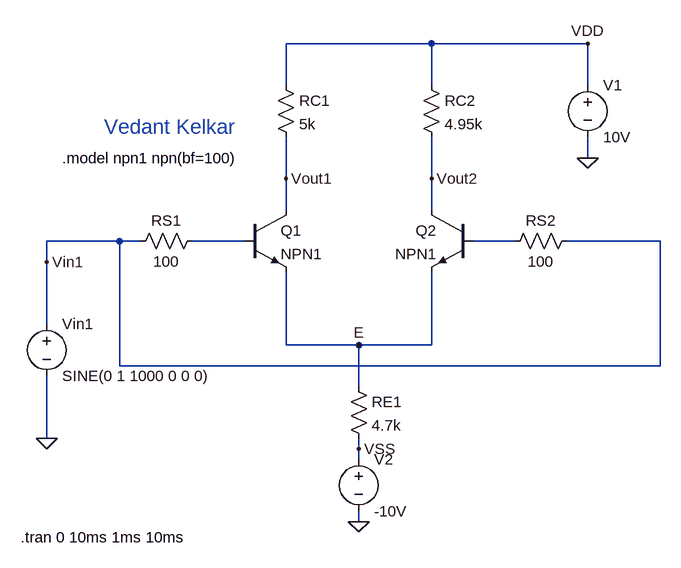
[diagram p0: schematic ECAD_exp9b.asc]
ECAD_exp9b.asc, the LTspice schematic file:
Version 4
SHEET 1 880 680
WIRE 192 -224 -32 -224
WIRE 432 -224 192 -224
WIRE -32 -160 -32 -224
WIRE 192 -160 192 -224
WIRE 432 -160 432 -224
WIRE 432 -48 432 -80
WIRE -32 -16 -32 -80
WIRE 192 -16 192 -80
WIRE -32 32 -32 -16
WIRE 192 32 192 -16
WIRE -288 80 -400 80
WIRE -256 80 -288 80
WIRE -96 80 -176 80
WIRE 320 80 256 80
WIRE 544 80 400 80
WIRE -400 112 -400 80
WIRE -400 208 -400 112
WIRE -32 240 -32 128
WIRE 80 240 -32 240
WIRE 192 240 192 128
WIRE 192 240 80 240
WIRE -288 272 -288 80
WIRE 544 272 544 80
WIRE 544 272 -288 272
WIRE 80 304 80 240
WIRE -400 384 -400 288
WIRE 80 400 80 384
WIRE 80 416 80 400
WIRE 80 512 80 496
FLAG -400 384 0
FLAG 80 240 E
FLAG 432 -48 0
FLAG 80 512 0
FLAG 432 -224 VDD
FLAG 80 400 VSS
FLAG -400 112 Vin1
FLAG -32 -16 Vout1
FLAG 192 -16 Vout2
SYMBOL voltage -400 192 R0
WINDOW 123 0 0 Left 0
WINDOW 39 0 0 Left 0
SYMATTR InstName Vin1
SYMATTR Value SINE(0 1 1000 0 0 0)
SYMBOL res -160 64 R90
WINDOW 0 0 56 VBottom 2
WINDOW 3 32 56 VTop 2
SYMATTR InstName RS1
SYMATTR Value 100
SYMBOL npn -96 32 R0
SYMATTR InstName Q1
SYMATTR Value NPN1
SYMBOL res -48 -176 R0
SYMATTR InstName RC1
SYMATTR Value 5k
SYMBOL res 416 64 R90
WINDOW 0 0 56 VBottom 2
WINDOW 3 32 56 VTop 2
SYMATTR InstName RS2
SYMATTR Value 100
SYMBOL npn 256 32 M0
SYMATTR InstName Q2
SYMATTR Value NPN1
SYMBOL res 176 -176 R0
SYMATTR InstName RC2
SYMATTR Value 4.95k
SYMBOL res 64 288 R0
SYMATTR InstName RE1
SYMATTR Value 4.7k
SYMBOL voltage 432 -176 R0
WINDOW 123 0 0 Left 0
WINDOW 39 0 0 Left 0
SYMATTR InstName V1
SYMATTR Value 10V
SYMBOL voltage 80 400 R0
WINDOW 123 0 0 Left 0
WINDOW 39 0 0 Left 0
SYMATTR InstName V2
SYMATTR Value -10V
TEXT -376 -48 Left 2 !.model npn1 npn(bf=100)
TEXT -440 536 Left 2 !.tran 0 10ms 1ms 10ms
TEXT -312 -96 Left 3 ;Vedant Kelkar

The netlist it stands for:
* ECAD_exp9b.asc
Vin1 Vin1 0 SINE(0 1 1000 0 0 0)
RS1 N001 Vin1 100
Q1 Vout1 N001 E 0 NPN1
RC1 VDD Vout1 5k
RS2 Vin1 N002 100
Q2 Vout2 N002 E 0 NPN1
RC2 VDD Vout2 4.95k
RE1 E VSS 4.7k
V1 VDD 0 10V
V2 VSS 0 -10V
.model NPN NPN
.model PNP PNP
.lib standard.bjt
.model npn1 npn(bf=100)
.tran 0 10ms 1ms 10ms
* Vedant Kelkar
.backanno
.end